# Altium schematic sheet TFillWindow.schDOC
size A4
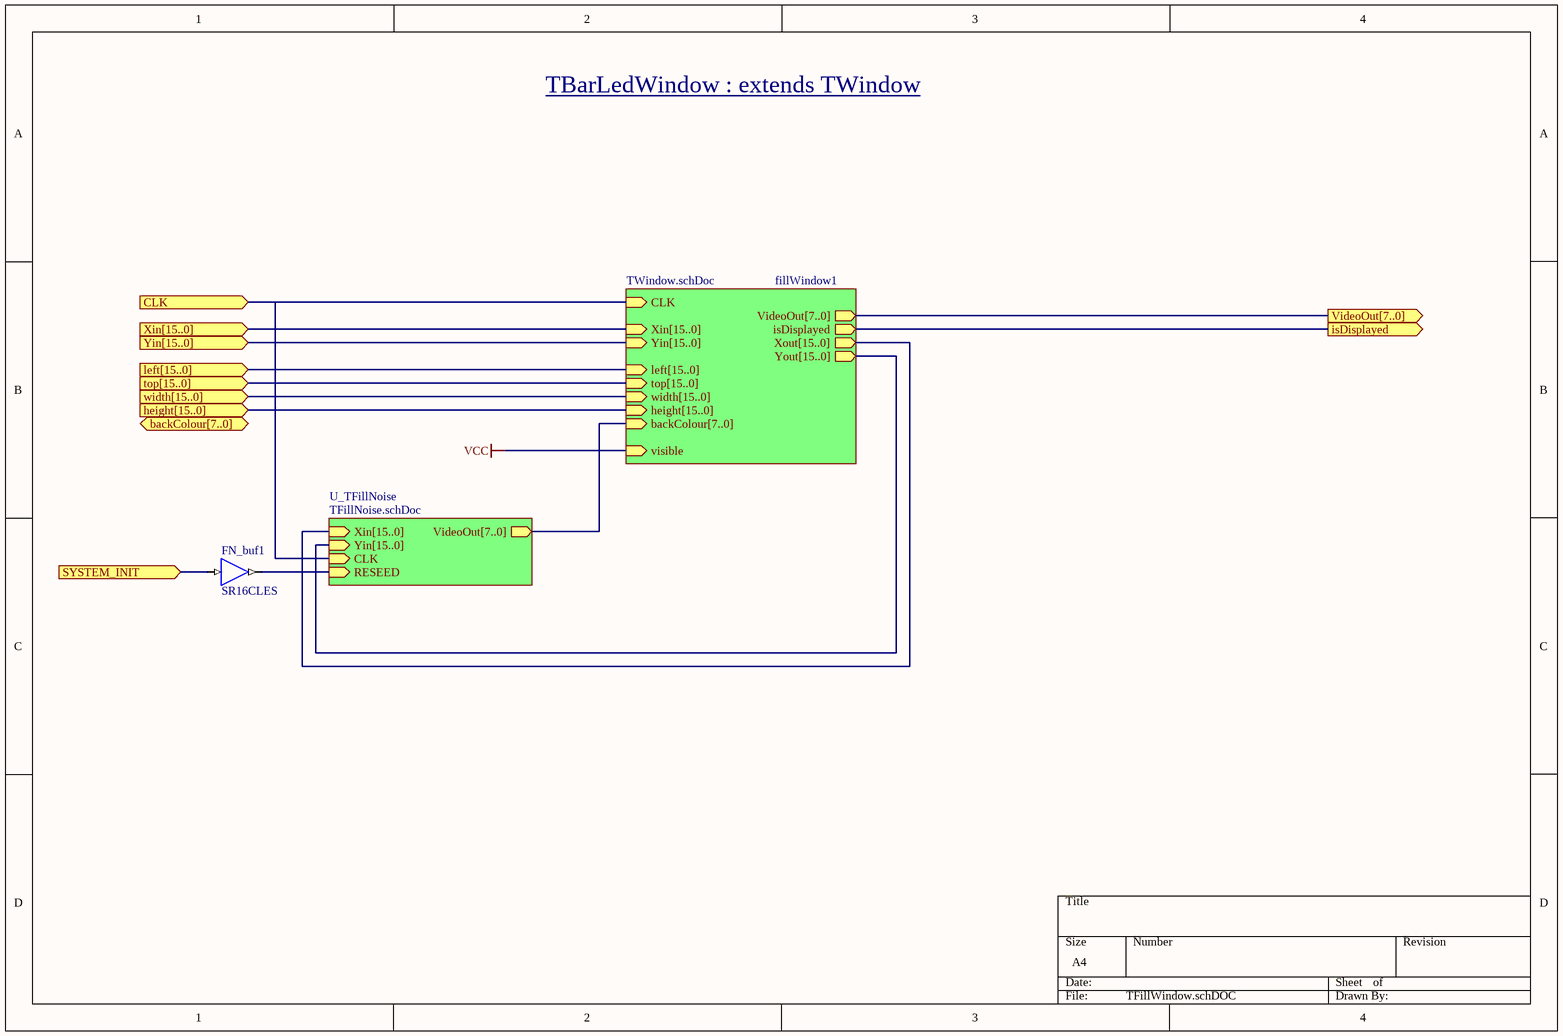
[diagram p0: TFillWindow.schDOC]

## Parts
FN_buf1  SR16CLES

## Sub-sheets
fillWindow1 = TWindow.schDoc: CLK (in), VideoOut[7..0] (out), Xin[15..0] (in), Yin[15..0] (in), top[15..0] (in), width[15..0] (in), height[15..0] (in), left[15..0] (in), Xout[15..0] (out), Yout[15..0] (out), backColour[7..0] (in), isDisplayed (out), visible (in)
U_TFillNoise = TFillNoise.schDoc: Xin[15..0] (in), Yin[15..0] (in), VideoOut[7..0] (out), CLK (in), RESEED (in)

## Ports
backColour[7..0] (in), CLK (in), height[15..0] (in), isDisplayed (out), left[15..0] (in), SYSTEM_INIT (in), top[15..0] (in), VideoOut[7..0] (out), width[15..0] (in), Xin[15..0] (in), Yin[15..0] (in)

## Nets
VCC: sheet fillWindow1/visible
CLK: port CLK, sheet fillWindow1/CLK, sheet U_TFillNoise/CLK
isDisplayed: port isDisplayed, sheet fillWindow1/isDisplayed
SYSTEM_INIT: FN_buf1.I ; port SYSTEM_INIT
NetFN_buf1_O: FN_buf1.O ; sheet U_TFillNoise/RESEED

## Buses and harness runs
bus port height[15..0] = sheet fillWindow1/height[15..0]
bus port left[15..0] = sheet fillWindow1/left[15..0]
bus port top[15..0] = sheet fillWindow1/top[15..0]
bus port VideoOut[7..0] = sheet fillWindow1/VideoOut[7..0]
bus port width[15..0] = sheet fillWindow1/width[15..0]
bus port Xin[15..0] = sheet fillWindow1/Xin[15..0]
bus port Yin[15..0] = sheet fillWindow1/Yin[15..0]
bus sheet fillWindow1/backColour[7..0] = sheet U_TFillNoise/VideoOut[7..0]
bus sheet fillWindow1/Xout[15..0] = sheet U_TFillNoise/Xin[15..0]
bus sheet fillWindow1/Yout[15..0] = sheet U_TFillNoise/Yin[15..0]

## Notes on the sheet
- TBarLedWindow : extends TWindow

## Library data of the parts
FN_buf1 = BUF: 1-bit General Purpose (Non-inverting) Buffer; ArchiveName: GENERIC; Published: 9-30-2003; Publisher: Altium Limited; Xilinx Equivalent: BUF; Core Revision: 1.00.00